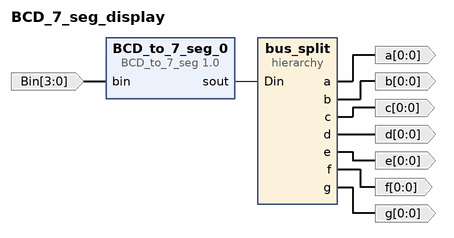
[diagram p0: block diagram of the top level]
# Vivado block design BCD_7_seg_display, xc7z010clg400-1, Vivado 2019.1
create_bd_design BCD_7_seg_display

create_bd_port -dir I -from 3 -to 0 -type data Bin
create_bd_port -dir O -from 0 -to 0 a
create_bd_port -dir O -from 0 -to 0 b
create_bd_port -dir O -from 0 -to 0 c
create_bd_port -dir O -from 0 -to 0 d
create_bd_port -dir O -from 0 -to 0 e
create_bd_port -dir O -from 0 -to 0 f
create_bd_port -dir O -from 0 -to 0 g

create_bd_cell -type ip -vlnv xilinx.com:user:BCD_to_7_seg:1.0 BCD_to_7_seg_0
create_bd_cell -type hier bus_split

# ---- hierarchy /bus_split ----
current_bd_instance /bus_split
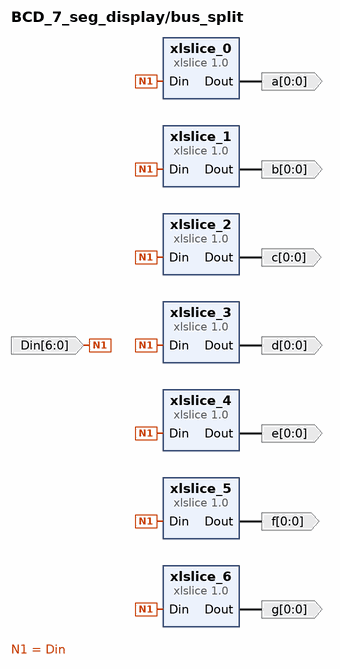
[diagram p1: block diagram inside /bus_split]
create_bd_pin -dir I -from 6 -to 0 Din
create_bd_pin -dir O -from 0 -to 0 b
create_bd_pin -dir O -from 0 -to 0 c
create_bd_pin -dir O -from 0 -to 0 d
create_bd_pin -dir O -from 0 -to 0 e
create_bd_pin -dir O -from 0 -to 0 f
create_bd_pin -dir O -from 0 -to 0 g
create_bd_pin -dir O -from 0 -to 0 a

create_bd_cell -type ip -vlnv xilinx.com:ip:xlslice:1.0 xlslice_1
set_property -dict {CONFIG.DIN_FROM 5 CONFIG.DIN_TO 5 CONFIG.DIN_WIDTH 7 CONFIG.DOUT_WIDTH 1} [get_bd_cells xlslice_1]
create_bd_cell -type ip -vlnv xilinx.com:ip:xlslice:1.0 xlslice_2
set_property -dict {CONFIG.DIN_FROM 4 CONFIG.DIN_TO 4 CONFIG.DIN_WIDTH 7 CONFIG.DOUT_WIDTH 1} [get_bd_cells xlslice_2]
create_bd_cell -type ip -vlnv xilinx.com:ip:xlslice:1.0 xlslice_3
set_property -dict {CONFIG.DIN_FROM 3 CONFIG.DIN_TO 3 CONFIG.DIN_WIDTH 7 CONFIG.DOUT_WIDTH 1} [get_bd_cells xlslice_3]
create_bd_cell -type ip -vlnv xilinx.com:ip:xlslice:1.0 xlslice_4
set_property -dict {CONFIG.DIN_FROM 2 CONFIG.DIN_TO 2 CONFIG.DIN_WIDTH 7 CONFIG.DOUT_WIDTH 1} [get_bd_cells xlslice_4]
create_bd_cell -type ip -vlnv xilinx.com:ip:xlslice:1.0 xlslice_5
set_property -dict {CONFIG.DIN_FROM 1 CONFIG.DIN_TO 1 CONFIG.DIN_WIDTH 7 CONFIG.DOUT_WIDTH 1} [get_bd_cells xlslice_5]
create_bd_cell -type ip -vlnv xilinx.com:ip:xlslice:1.0 xlslice_6
set_property -dict {CONFIG.DIN_FROM 0 CONFIG.DIN_TO 0 CONFIG.DIN_WIDTH 7 CONFIG.DOUT_WIDTH 1} [get_bd_cells xlslice_6]
create_bd_cell -type ip -vlnv xilinx.com:ip:xlslice:1.0 xlslice_0
set_property -dict {CONFIG.DIN_FROM 6 CONFIG.DIN_TO 6 CONFIG.DIN_WIDTH 7 CONFIG.DOUT_WIDTH 1} [get_bd_cells xlslice_0]

# ---- connections ----

current_bd_instance /bus_split
connect_bd_net -net BCD_to_7_seg_0_sout [get_bd_pins Din] \
  [get_bd_pins xlslice_0/Din] [get_bd_pins xlslice_2/Din] [get_bd_pins xlslice_3/Din] [get_bd_pins xlslice_4/Din] \
  [get_bd_pins xlslice_5/Din] [get_bd_pins xlslice_6/Din] [get_bd_pins xlslice_1/Din]
connect_bd_net [get_bd_pins xlslice_1/Dout] [get_bd_pins b]
connect_bd_net [get_bd_pins xlslice_2/Dout] [get_bd_pins c]
connect_bd_net [get_bd_pins xlslice_3/Dout] [get_bd_pins d]
connect_bd_net [get_bd_pins xlslice_4/Dout] [get_bd_pins e]
connect_bd_net [get_bd_pins xlslice_5/Dout] [get_bd_pins f]
connect_bd_net [get_bd_pins xlslice_6/Dout] [get_bd_pins g]
connect_bd_net [get_bd_pins xlslice_0/Dout] [get_bd_pins a]

current_bd_instance /
connect_bd_net [get_bd_ports Bin] [get_bd_pins BCD_to_7_seg_0/bin]
connect_bd_net [get_bd_pins BCD_to_7_seg_0/sout] [get_bd_pins bus_split/Din]
connect_bd_net -net xlslice_1_Dout [get_bd_pins bus_split/b] [get_bd_ports b]
connect_bd_net -net xlslice_0_Dout [get_bd_pins bus_split/a] [get_bd_ports a]
connect_bd_net -net xlslice_2_Dout [get_bd_pins bus_split/c] [get_bd_ports c]
connect_bd_net -net xlslice_3_Dout [get_bd_pins bus_split/d] [get_bd_ports d]
connect_bd_net -net xlslice_4_Dout [get_bd_pins bus_split/e] [get_bd_ports e]
connect_bd_net -net xlslice_5_Dout [get_bd_pins bus_split/f] [get_bd_ports f]
connect_bd_net -net xlslice_6_Dout [get_bd_pins bus_split/g] [get_bd_ports g]

validate_bd_design
save_bd_design
